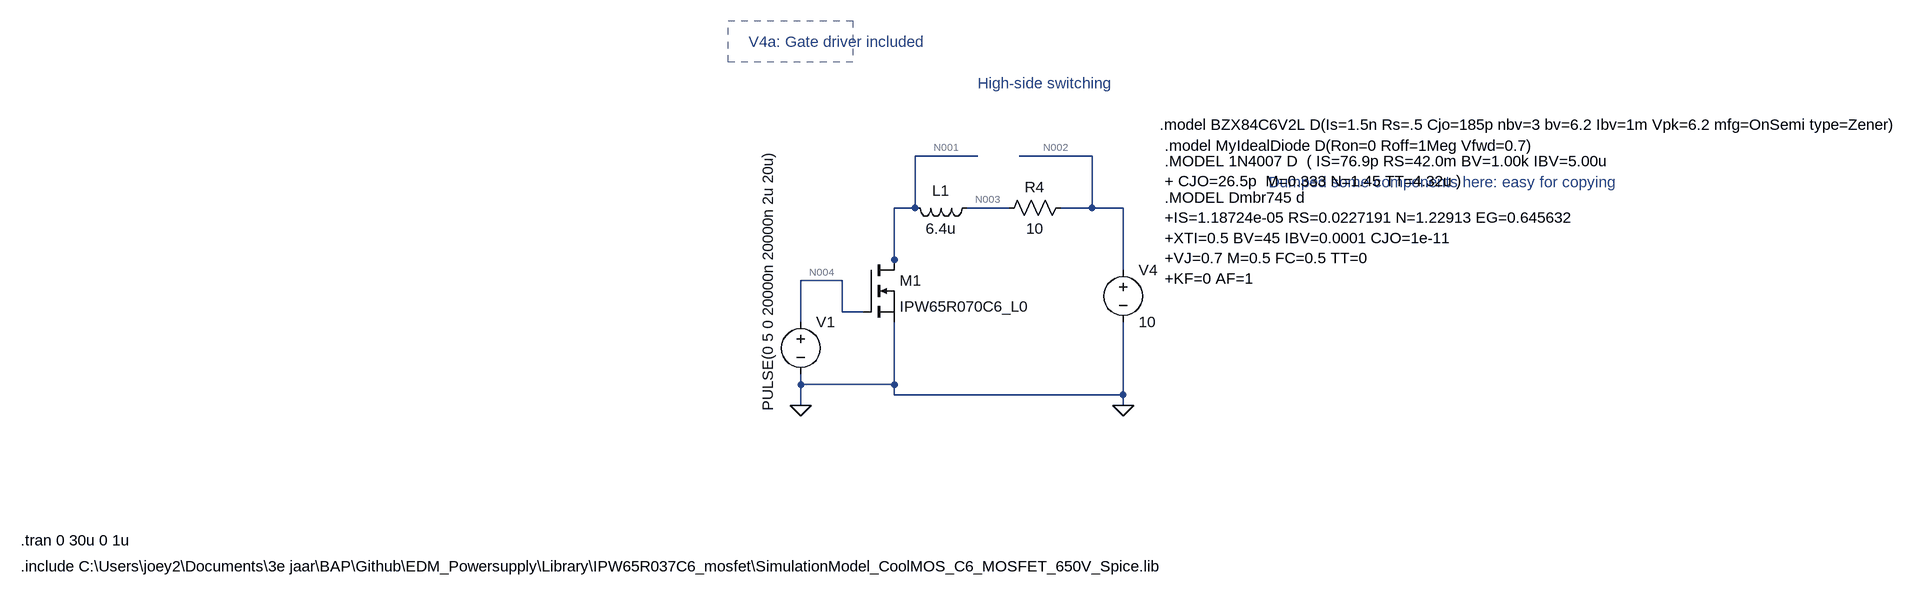
[diagram p0: schematic EDM_Powersupply_V4_freq.asc]
EDM_Powersupply_V4_freq.asc, the LTspice schematic file:
Version 4
SHEET 1 1876 680
WIRE 752 -112 656 -112
WIRE 928 -112 816 -112
WIRE 656 -32 656 -112
WIRE 656 -32 624 -32
WIRE 800 -32 736 -32
WIRE 928 -32 928 -112
WIRE 928 -32 880 -32
WIRE 976 -32 928 -32
WIRE 624 48 624 -32
WIRE 624 64 624 48
WIRE 976 64 976 -32
WIRE 544 80 480 80
WIRE 544 128 544 80
WIRE 576 128 544 128
WIRE 480 144 480 80
WIRE 480 240 480 224
WIRE 624 240 624 144
WIRE 624 240 480 240
WIRE 624 256 624 240
WIRE 976 256 976 144
WIRE 976 256 624 256
WIRE 480 272 480 240
WIRE 976 272 976 256
FLAG 480 272 0
FLAG 976 272 0
SYMBOL voltage 480 128 R0
WINDOW 123 0 0 Left 0
WINDOW 39 0 0 Left 0
WINDOW 3 -51 153 VLeft 2
SYMATTR Value PULSE(0 5 0 20000n 20000n 2u 20u)
SYMATTR InstName V1
SYMBOL res 896 -48 R90
WINDOW 0 0 56 VBottom 2
WINDOW 3 32 56 VTop 2
SYMATTR InstName R4
SYMATTR Value 10
SYMBOL voltage 976 48 R0
WINDOW 123 0 0 Left 0
WINDOW 39 0 0 Left 0
SYMATTR InstName V4
SYMATTR Value 10
SYMBOL ind 752 -48 R90
WINDOW 0 5 56 VBottom 2
WINDOW 3 32 56 VTop 2
SYMATTR InstName L1
SYMATTR Value 6.4u
SYMATTR SpiceLine IC=0A
SYMBOL nmos 576 48 R0
SYMATTR InstName M1
SYMATTR Value IPW65R070C6_L0
SYMATTR Prefix X
TEXT -720 520 Left 2 !.include C:\\Users\\joey2\\Documents\\3e jaar\\BAP\\Github\\EDM_Powersupply\\Library\\IPW65R037C6_mosfet\\SimulationModel_CoolMOS_C6_MOSFET_650V_Spice.lib
TEXT -720 480 Left 2 !.tran 0 30u 0 1u
TEXT 752 -224 Left 2 ;High-side switching
TEXT 1200 -72 Left 2 ;Dumped some components here: easy for copying
TEXT 1032 -160 Left 2 !.model BZX84C6V2L D(Is=1.5n Rs=.5 Cjo=185p nbv=3 bv=6.2 Ibv=1m Vpk=6.2 mfg=OnSemi type=Zener)
TEXT 1040 -128 Left 2 !.model MyIdealDiode D(Ron=0 Roff=1Meg Vfwd=0.7)
TEXT 400 -288 Left 2 ;V4a: Gate driver included
TEXT 1040 -104 Left 2 !.MODEL 1N4007 D  ( IS=76.9p RS=42.0m BV=1.00k IBV=5.00u\n+ CJO=26.5p  M=0.333 N=1.45 TT=4.32u )
TEXT 1040 -48 Left 2 !.MODEL Dmbr745 d\n+IS=1.18724e-05 RS=0.0227191 N=1.22913 EG=0.645632\n+XTI=0.5 BV=45 IBV=0.0001 CJO=1e-11\n+VJ=0.7 M=0.5 FC=0.5 TT=0\n+KF=0 AF=1
RECTANGLE Normal 560 -256 368 -320 2

The netlist it stands for:
* EDM_Powersupply_V4_freq.asc
V1 N004 0 PULSE(0 5 0 20000n 20000n 2u 20u)
R4 N002 N003 10
V4 N002 0 10
L1 N003 N001 6.4u IC=0A
XM1 N001 N004 0 IPW65R070C6_L0  ; pins D G S
.include C:\Users\joey2\Documents\3e jaar\BAP\Github\EDM_Powersupply\Library\IPW65R037C6_mosfet\SimulationModel_CoolMOS_C6_MOSFET_650V_Spice.lib
.tran 0 30u 0 1u
* High-side switching
* Dumped some components here: easy for copying
.model BZX84C6V2L D(Is=1.5n Rs=.5 Cjo=185p nbv=3 bv=6.2 Ibv=1m Vpk=6.2 mfg=OnSemi type=Zener)
.model MyIdealDiode D(Ron=0 Roff=1Meg Vfwd=0.7)
* V4a: Gate driver included
.MODEL 1N4007 D  ( IS=76.9p RS=42.0m BV=1.00k IBV=5.00u
+ CJO=26.5p  M=0.333 N=1.45 TT=4.32u )
.MODEL Dmbr745 d
+IS=1.18724e-05 RS=0.0227191 N=1.22913 EG=0.645632
+XTI=0.5 BV=45 IBV=0.0001 CJO=1e-11
+VJ=0.7 M=0.5 FC=0.5 TT=0
+KF=0 AF=1
.backanno
.end

* Results of the author's LTspice run, read from the files saved beside the schematic
* Operating Point, zero values left out:
*   V(n002) = 10 V
*   V(n003) = 10 V
*   V(n001) = 10 V
*   I(L1) = 1 µA
*   I(R4) = 1 µA
*   I(V4) = -1 µA
*   I(V1) = 1 µA
*   Ix(m1:DRAIN) = 1 µA
*   Ix(m1:GATE) = -1 µA
*   Ix(m1:SOURCE) = -48.92 pA
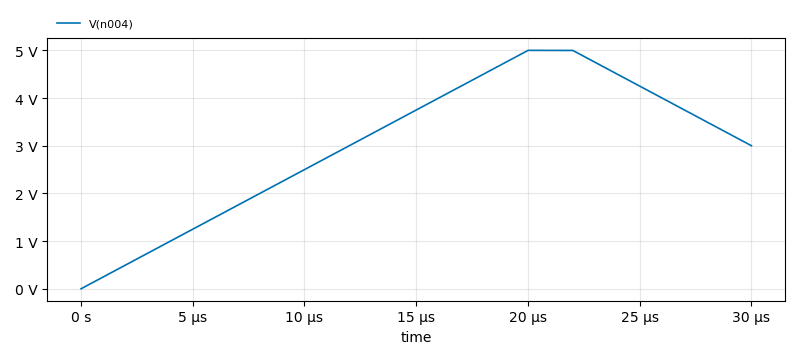
[diagram p1: Transient Analysis of EDM_Powersupply_V4_freq.asc, plotted from the saved traces]
* Transient Analysis, 1 run:
*   V(n004): min 0 V, max 5 V, average 3.067 V, rms 3.404 V, last 3 V